# Altium schematic sheet HMC1053-cell.SchDoc
size A; SheetNumber: 2; SheetTotal: 2
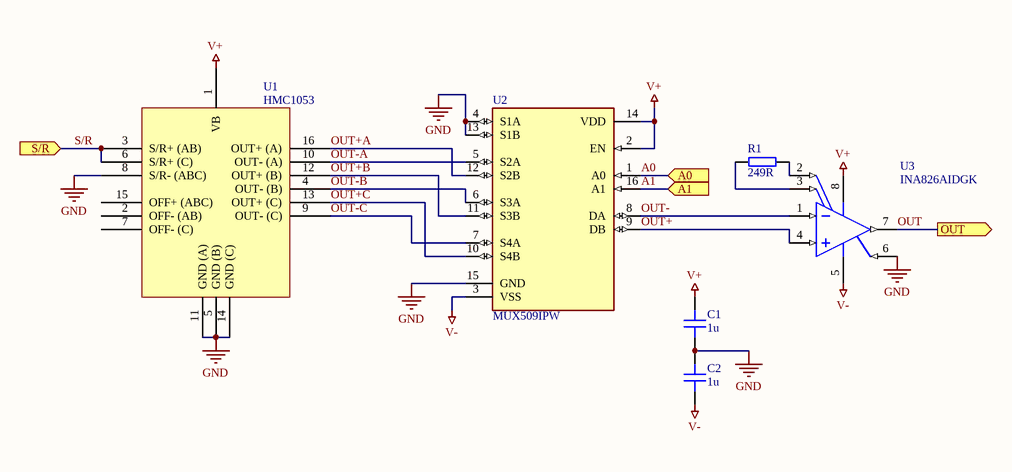
[diagram p0: HMC1053-cell.SchDoc]

## Parts
C1  1u  [CAP_0402]
C2  1u  [CAP_0402]
R1  249R  [RES_0402]
U1  HMC1053  [HMC1053]
U2  MUX509IPW  [MUX509IPW]
U3  INA826AIDGK  [INA826AIDGK]

## Ports
A0 (in, see HMC1053-array[1A]), A1 (in, see HMC1053-array[1B]), OUT (out, see HMC1053-array[1A]), S/R (in, see HMC1053-array[1B])

## Nets
GND: C1.1 C2.2 U1.5(GND_(B)) U1.8(S/R-_(ABC)) U1.11(GND_(A)) U1.14(GND_(C)) U2.4(S1A) U2.13(S1B) U2.15(GND) U3.6(REF)
V+: C1.2 U1.1(VB) U2.2(EN) U2.14(VDD) U3.8(VS+)
V-: C2.1 U2.3(VSS) U3.5(VS-)
A0: U2.1(A0) ; port A0
A1: U2.16(A1) ; port A1
OUT: U3.7(VOUT) ; port OUT
OUT+: U2.9(DB) U3.4(IN+)
OUT+A: U1.16(OUT+_(A)) U2.12(S2B)
OUT+B: U1.12(OUT+_(B)) U2.11(S3B)
OUT+C: U1.13(OUT+_(C)) U2.10(S4B)
OUT-: U2.8(DA) U3.1(IN-)
OUT-A: U1.10(OUT-_(A)) U2.5(S2A)
OUT-B: U1.4(OUT-_(B)) U2.6(S3A)
OUT-C: U1.9(OUT-_(C)) U2.7(S4A)
S/R: U1.3(S/R+_(AB)) U1.6(S/R+_(C)) ; port S/R
NetR1_1: R1.1 U3.2(RG)
NetR1_2: R1.2 U3.3(RG)

Not connected (* = marked no-connect by the designer): U1 2(OFF-_(AB)) 7(OFF-_(C)) 15(OFF+_(ABC))

## Library data of the parts
C1 C2 = CAP_0402: Capacitor SMD 0402; Voltage: 50V; Capacitance: 1u
R1 = RES_0402: Resistor SMD 0402; Resistance: 249R
U1 = HMC1053: 3-axis magnetoresistive sensor; Manufacturer: Honeywell; Operating Supply Voltage: 3V; Output Type: Wheatstone Bridge; Axis: X, Y, Z; Nominal Supply Current: 500mA; Min Supply Voltage: 1.8V; Max Supply Voltage: 20V; Bandwidth: 5MHz; Supplier 1: Newark; Manufacturer Part Number: HMC1053; RoHS: No; Category: Magnetic Sensors; Case/Package: PLCC; Number of Pins: 16; Min Operating Temperature: -40°C; Max Operating Temperature: 125°C; Package Quantity: 66; Packaging: Tape and Reel; Sensing Method: Magnetoresistive; Length: 7.4mm; Width: 7.4mm; Height: 2.5mm; Radiation Hardening: No; ComponentLink1URL: https://datasheet.ciiva.com/15099/getdatasheetpartid-59250-15099355.pdf?src-supplier=Verical; ComponentLink1Description: https://datasheet.ciiva.com/15099/getdatasheetpartid-59250-15099355.pdf?src-supplier=Verical; ComponentLink2URL: https://datasheet.ciiva.com/2816/hmc-1051-1052-1053-data-sheet-2816521.pdf?src-supplier=Digi-Key; ComponentLink2Description: https://datasheet.ciiva.com/2816/hmc-1051-1052-1053-data-sheet-2816521.pdf?src-supplier=Digi-Key
U2 = MUX509IPW: IC MUX DUAL 4:1 170 OHM 16TSSOP; Number of Circuits: 4; Number of Channels: 2; On-State Resistance: 250R; Number of Pins: 16; Case/Package: TSSOP; Min Operating Temperature: -40°C; Max Operating Temperature: 125°C; REACH SVHC: No SVHC; RoHS Compliant: Yes; Packaging: Cut Tape; Lead Free: Lead Free
U3 = INA826AIDGK: Precision, 200-uA Supply Current, 36-V Supply Instrumentation Amplifier, -40 to 125 degC, 8-pin SOP (DGK8), Green (RoHS & no Sb/Br); Manufacturer: Texas Instruments; Quiescent Current (+/-)(Typ)(mA): 0.2; Noise at 1kHz(Typ)(nV/rt(Hz)): 18; Input Offset (+/-)(Max)(uV): 150; Vs(Min)(V): 2.7; Number of Channels: 1; SubFamily: Single Supply; Output Offset Drift (+/-)(Max)(uV/Degrees Celsius): 10; Input Bias Current (+/-)(Max)(nA): 65; CMRR(Min)(dB): 84; Vs(Max)(V): 36; Non-Linearity (+/-)(Max)(%): 0.0005; Gain(V/V): 1 to 1000; Input Offset Drift (+/-)(Max)(uV/Degrees Celsius): 2; Output Offset (+/-)(Max)(uV): 700; Code_JEDEC: MO-187; PackageReference: DGK0008A; ComponentLink1Description: Manufacturer URL; ComponentLink3URL: http://www.ti.com/litv/pdf/mpds028d; PartNumber: INA826AIDGK; DatasheetVersion: SBOS562E; ComponentLink2Description: Datasheet; PackageDescription: 8-Pin Thin Small Outline, Body 3 x 3 mm, Pitch 0.65 mm; ComponentLink1URL: http://www.ti.com/; Mounting Technology: Surface Mount; ComponentLink2URL: http://www.ti.com/general/docs/lit/getliterature.tsp?genericPartNumber=INA826&fileType=pdf; ComponentLink3Description: Package Specification; Eco-Plan: Green (RoHS & no Sb/Br); PackageVersion: 4073329/E, 05/2006